# Altium project EDR_V1.PrjPcb
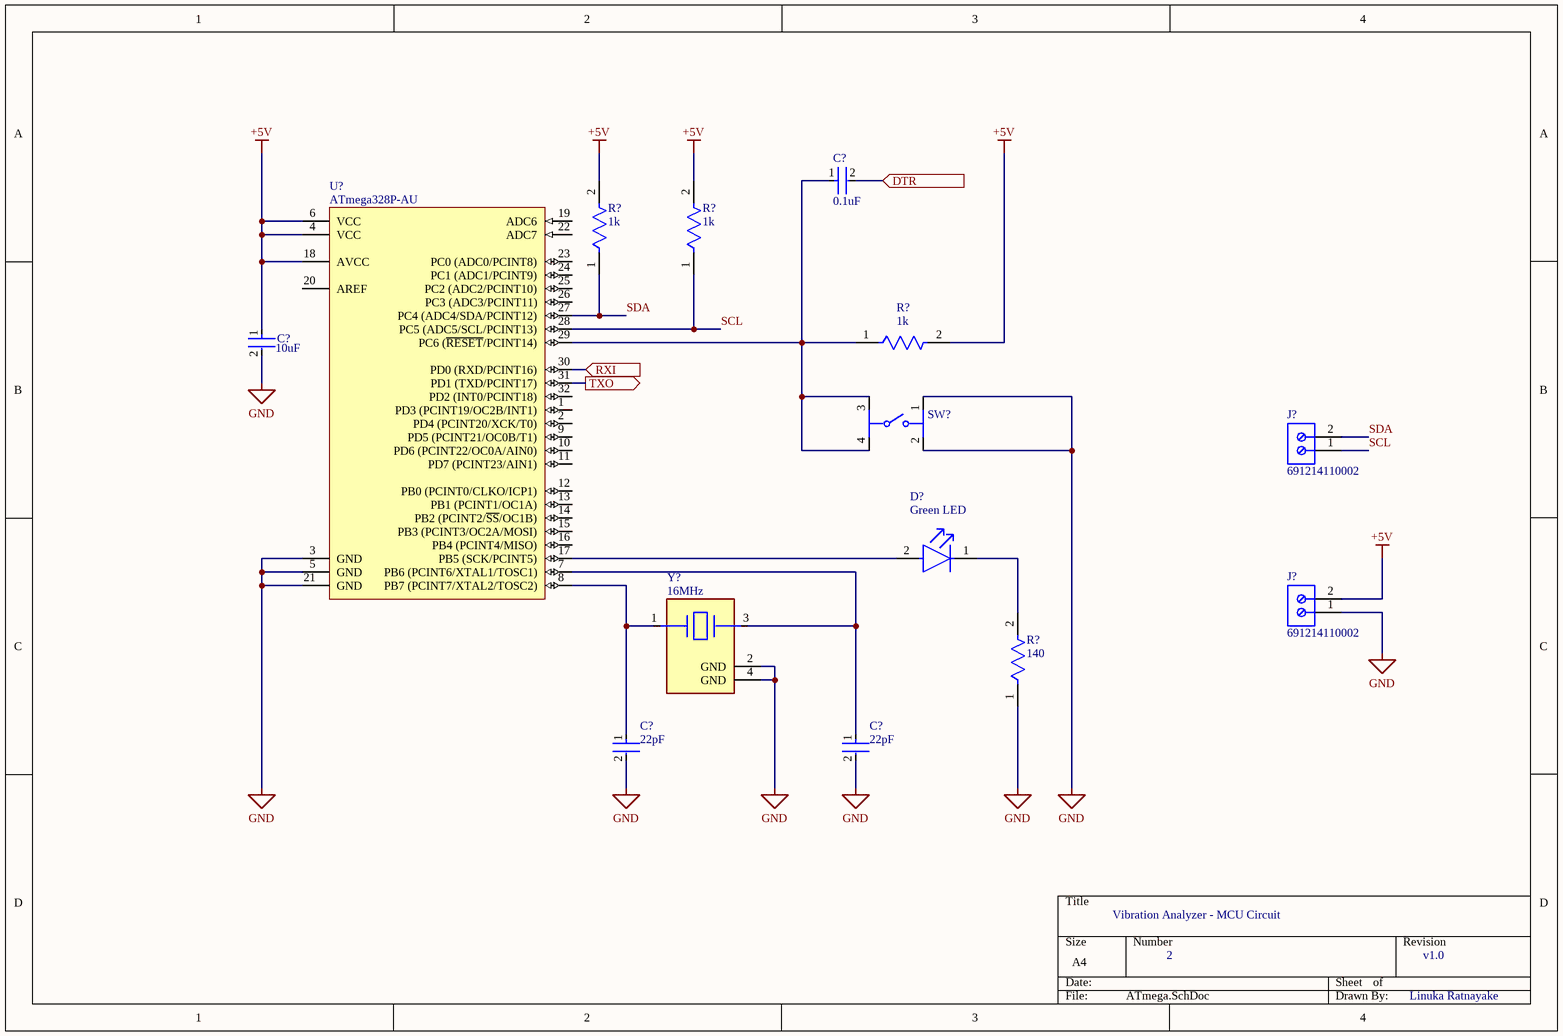
[diagram p0: ATmega.SchDoc]
4 sheets, 39 parts. Net scope: flat (ports and power ports of the same name join across sheets).
Board file: PCB1.PcbDoc
Sheets:
  ATmega.SchDoc
  Power.SchDoc
  FTDI.SchDoc
  Main.SchDoc

## Sheet ATmega.SchDoc
size A4; SheetNumber: 3; SheetTotal: 4

### Parts
(Parts that share a designator on the sheet are numbered #1, #2 ... from top to bottom, then left to right.)
C?#1  Capacitance: 0.1uF  [FP-GRM31M-0_15-IPC_A]  (hidden comment: GRM31M1X1H104JA01L)
C?#2  Capacitance: 10uF  [FP-GRM31M-0_15-IPC_A]  (hidden comment: GRM31M1X1H104JA01L)
C?#3  Capacitance: 22pF  [FP-GRM31M-0_15-IPC_A]  (hidden comment: GRM31M1X1H104JA01L)
C?#4  Capacitance: 22pF  [FP-GRM31M-0_15-IPC_A]  (hidden comment: GRM31M1X1H104JA01L)
D?#1  Color: Green LED  [FP-HSMG-C150-MFG]  (hidden comment: HSMG-C150)
J?#1  691214110002  [691214110002]
J?#2  691214110002  [691214110002]
R?#1  Resistance: 1k  [FP-MCR18-IPC_B]  (hidden comment: MCR18EZPF30R0)
R?#2  Resistance: 1k  [FP-MCR18-IPC_B]  (hidden comment: MCR18EZPF30R0)
R?#3  Resistance: 1k  [FP-MCR18-IPC_B]  (hidden comment: MCR18EZPF30R0)
R?#4  Resistance: 140  [FP-MCR18-IPC_B]  (hidden comment: MCR18EZPF30R0)
SW?#1  PTS645SM43SMTR92LFS  [FP-PTS645SM43SMTR92LFS-MFG]  (value not drawn)
U?#1  ATmega328P-AU  [32A_M]
Y?#1  Frequency: 16MHz  [FP-ABM11-MFG]  (hidden comment: ABM11-16.000MHZ-12-N1G-T)

### Ports
DTR (in, see Main[2B], FTDI[3B]), RXI (in, see Main[2B]), TXO (out, see Main[2B])

### Nets
+5V: C?#2.1 J?#2.2 R?#1.2 R?#2.2 R?#3.2 U?#1.4(VCC) U?#1.6(VCC) U?#1.18(AVCC)
GND: C?#2.2 C?#3.2 C?#4.2 J?#2.1 R?#4.1 SW?#1.1 SW?#1.2 U?#1.3(GND) U?#1.5(GND) U?#1.21(GND) Y?#1.2(GND) Y?#1.4(GND)
SCL: J?#1.1 R?#2.1 U?#1.28(PC5_(ADC5/SCL/PCINT13))
SDA: J?#1.2 R?#1.1 U?#1.27(PC4_(ADC4/SDA/PCINT12))
NetC?#1_1: C?#1.1 R?#3.1 SW?#1.3 SW?#1.4 U?#1.29(PC6_(~{RESET}/PCINT14))
NetC?#1_2: C?#1.2 ; port DTR
NetC?#3_1: C?#3.1 U?#1.8(PB7_(PCINT7/XTAL2/TOSC2)) Y?#1.1
NetC?#4_1: C?#4.1 U?#1.7(PB6_(PCINT6/XTAL1/TOSC1)) Y?#1.3
NetD?#1_1: D?#1.1(C) R?#4.2
NetD?#1_2: D?#1.2(A) U?#1.17(PB5_(SCK/PCINT5))
NetU?#1_30: U?#1.30(PD0_(RXD/PCINT16)) ; port RXI
NetU?#1_31: U?#1.31(PD1_(TXD/PCINT17)) ; port TXO

Not connected (* = marked no-connect by the designer): U?#1 1(PD3_(PCINT19/OC2B/INT1)) 2(PD4_(PCINT20/XCK/T0)) 9(PD5_(PCINT21/OC0B/T1)) 10(PD6_(PCINT22/OC0A/AIN0)) 11(PD7_(PCINT23/AIN1)) 12(PB0_(PCINT0/CLKO/ICP1)) 13(PB1_(PCINT1/OC1A)) 14(PB2_(PCINT2/~{SS}/OC1B)) 15(PB3_(PCINT3/OC2A/MOSI)) 16(PB4_(PCINT4/MISO)) 19(ADC6) 20(AREF) 22(ADC7) 23(PC0_(ADC0/PCINT8)) 24(PC1_(ADC1/PCINT9)) 25(PC2_(ADC2/PCINT10)) 26(PC3_(ADC3/PCINT11)) 32(PD2_(INT0/PCINT18))

### Notes on the sheet
- Vibration Analyzer - MCU Circuit
- 2
- v1.0
- Linuka Ratnayake

### Library data of the parts
C?#1-C?#4 = CMP-06035-007547-1: Chip Multilayer Ceramic Capacitors for General Purpose, 1206, 0.10uF, SL, +350/-1000ppm/°C, 5%, 50V; Dissipation Factor: 0.025%; Packaging: Tape and Reel; Length: 0.126inch; Case Code (Imperial): 1206; Voltage Rating (DC): 50V; Max Operating Temperature: 125°C; Voltage: 50V; Height: 1.15mm; Width: 0.063inch; Voltage Rating: 50V; Tolerance: 5%; Min Operating Temperature: -55°C; Mount: Surface Mount; Dielectric Material: Ceramic; Termination: SMD/SMT; Depth: 1.6mm; Case Code (Metric): 3216; Case/Package: 1206; Temperature Coefficient: -1000ppm/°C; Thickness: 0.049inch
D?#1 = CMP-2000-05061-2: LED GREEN DIFFUSED 1206 SMD; Manufacturer: Broadcom; Led Orientation: Top View; Max Junction Temp: +95°C; Peak Emmision Wavelength: 570nm; Viewing Angle: 170°; Wavelength: 572nm; Reverse Voltage: 5V; Luminous Intensity: 15mcd; Description: Surface Mount Chip LEDs; Forward Voltage: 2.2V; Power Dissipation: 65mW; Forward Current: 20mA; ComponentLink2Description: Datasheet; Lead Free: Yes; Temperature Range Low: -40°C; Package: HSMG-C150; Digikey Description: LED GREEN DIFFUSED 1206 SMD; Mouser Description: LED Uni-Color Green 570nm 2-Pin Chip LED T/R; Manufacturer Part Number: HSMG-C150; Temperature Range High: +85°C; Device Class L1: Optoelectronics; Colour: Green; Category: Diode; Device Class L3: unset; RoHS: TRUE; Height: 1.2mm; ComponentLink2URL: https://docs.broadcom.com/docs/AV02-0551EN; Device Class L2: LEDs; Automotive: No; Ipc Land Pattern Name: DIOCP320160X55; Octopart: https://octopart.com/hsmg-c150-broadcom-71131304; Temperature: -40°C to +85°C
J?#1 J?#2 = CMP-1502-02464-2: NexarPartId: 18818288; Plating: Brass, Steel; Current: 10A; Pitch: 3.5052mm; Number of Levels: 1; Number of Contacts: 2; Wire Gauge (Min): 16AWG; Voltage: 300V; Wire Gauge (Max): 24AWG; Stripping Length: -6mm; Number of Pins: 2; Number of Rows: 1; REACH SVHC: Unknown; RoHS: Compliant; Housing Material: Nylon; Termination: Screw; Mount: Through Hole; Contact Plating: Brass, Tin; Number of Positions Per Level: 2; Color: Blue, Green; Width: 7.9mm; Voltage Rating: 300V; Length: 7.4mm; Current Rating: 10A; Wire/Cable Gauge: 24AWG; Packaging: Box; Max Operating Temperature: 105°C; Lead Pitch: 3.5mm; Height: 8.7mm; Contact Material: Brass; Min Operating Temperature: -40°C
R?#1-R?#4 = CMP-08839-012195-1: Thick Film Chip Resistor, 1206, 30Ω, 1%, 100ppm/°C, 0.25W, 200V; Max Power Dissipation: 250mW; Case Code (Imperial): 1206; Case Code (Metric): 3216; Resistor Type: Thick Film; Tolerance: 1%; Package Quantity: 5000; Height: 0.026inch; RoHS Compliant: Yes; Series: MCR18; Number of Terminations: 2; Lead Free: Lead Free; Width: 0.063inch; Length: 0.126inch; Case/Package: 1206; Packaging: Tape and Reel; Features: Automotive AEC-Q200; Voltage Rating (DC): 200V; Temperature Coefficient: 100ppm/°C
SW?#1 = CMP-2000-05160-2: SWITCH TACTILE SPST-NO 0.05A 12V; Contact Resistance: 100mR; Throw Configuration: SPST; Illumination Type: Non-Illuminated; Mechanical Life: 100000Cycles; Current Rating: 50mA; Switch Function: Off-Mom; Actuator Length: 0.85mm; Actuator Material: Nylon; Actuator Type: Standard; Operating Force: 160gf; Min Operating Temperature: -20°C; REACH SVHC: No SVHC; Termination: Gull Wing; Case/Package: SMD/SMT; Packaging: Tape and Reel; Mount: Surface Mount; Voltage Rating (DC): 12V; Orientation: Straight; Lead Free: Lead Free; Contact Material: Silver; Color: Black; Max Current Rating: 50mA; Contact Plating: Silver; Depth: 9mm; Package Quantity: 1; Max Voltage Rating (DC): 12V; Length: 6mm; Max Operating Temperature: 60°C
U?#1 = CMP-0095-00269-2: 8-bit AVR Microcontroller, 32KB Flash, 1KB EEPROM, 2KB SRAM, 32-pin TQFP, Industrial Grade (-40°C to 85°C); PackageDescription: 32-Lead, 7x7x1.0 mm Body, 0.8mm Lead Pitch, Thin Profile Plastic Quad Flat Package (TQFP); DatasheetVersion: revD, May-2011; RevisionNote: DatasheetVersion & PackageVersion updated. URLs added.; ComponentLink1URL: http://www.atmel.com/; ComponentLink2Description: ATmega48A/48PA/88A/88PA/168A/168PA/328/328P Datasheet; Code_JEDEC: MS-026-ABA; ComponentLink1Description: Manufacturer URL; PackageReference: 32A; ComponentLink3Description: ATmega48A/48PA/88A/88PA/168A/168PA/328/328P Summary; ComponentLink2URL: http://www.atmel.com/dyn/resources/prod_documents/doc8271.pdf; PackageVersion: revC, Oct-2010; ComponentLink3URL: http://www.atmel.com/dyn/resources/prod_documents/8271S.pdf
Y?#1 = CMP-27762-009218-1: Crystal 16MHz ±10ppm 12pF SMD-4 2mm x 1.6mm

## Sheet Power.SchDoc
size A; SheetNumber: 2; SheetTotal: 2

## Sheet FTDI.SchDoc
size A4; SheetNumber: 4; SheetTotal: 4
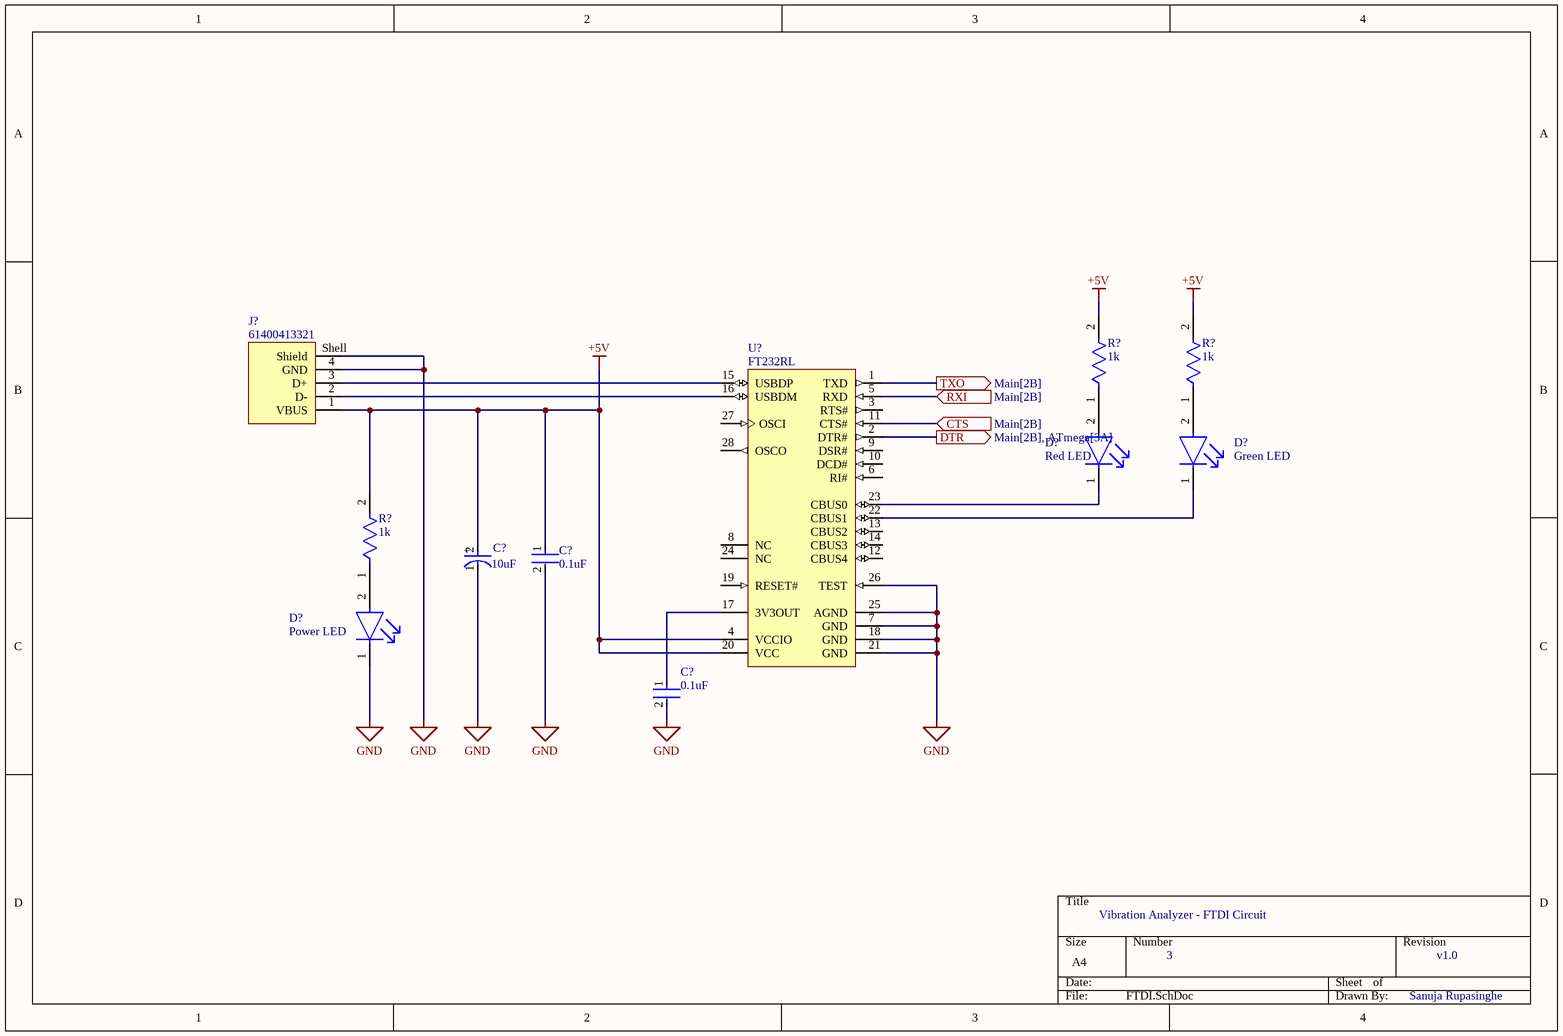
[diagram p1: FTDI.SchDoc]

### Parts
(Parts that share a designator on the sheet are numbered #1, #2 ... from top to bottom, then left to right.)
C?#5  Capacitance: 10uF  [FP-SC-MFG]  (hidden comment: EEE1VA100SR)
C?#6  Capacitance: 0.1uF  [FP-GRM31M-0_15-IPC_A]  (hidden comment: GRM31M1X1H104JA01L)
C?#7  Capacitance: 0.1uF  [FP-GRM31M-0_15-IPC_A]  (hidden comment: GRM31M1X1H104JA01L)
D?#2  Color: Red LED  [FP-HSMG-C150-MFG]  (hidden comment: HSMG-C150)
D?#3  Color: Green LED  [FP-HSMG-C150-MFG]  (hidden comment: HSMG-C150)
D?#4  Color: Power LED  [FP-HSMG-C150-MFG]  (hidden comment: HSMG-C150)
J?#3  61400413321  [61400413321]
R?#5  Resistance: 1k  [FP-MCR18-IPC_B]  (hidden comment: MCR18EZPF30R0)
R?#6  Resistance: 1k  [FP-MCR18-IPC_B]  (hidden comment: MCR18EZPF30R0)
R?#7  Resistance: 1k  [FP-MCR18-IPC_B]  (hidden comment: MCR18EZPF30R0)
U?#2  FT232RL  [FTDI-SSOP-28_M]

### Ports
CTS (in, see Main[2B]), DTR (out, see Main[2B], ATmega[3A]), RXI (in, see Main[2B]), TXO (out, see Main[2B])

### Nets
+5V: C?#5.2(A) C?#6.1 J?#3.1(VBUS) R?#5.2 R?#6.2 R?#7.2 U?#2.4(VCCIO) U?#2.20(VCC)
GND: C?#5.1(C) C?#6.2 C?#7.2 D?#4.1(C) J?#3.4(GND) J?#3.Shell(Shield) U?#2.7(GND) U?#2.18(GND) U?#2.21(GND) U?#2.25(AGND) U?#2.26(TEST)
NetC?#1_2: U?#2.2(DTR#) ; port DTR
NetC?#7_1: C?#7.1 U?#2.17(3V3OUT)
NetD?#2_1: D?#2.1(C) U?#2.23(CBUS0)
NetD?#2_2: D?#2.2(A) R?#5.1
NetD?#3_1: D?#3.1(C) U?#2.22(CBUS1)
NetD?#3_2: D?#3.2(A) R?#6.1
NetD?#4_2: D?#4.2(A) R?#7.1
NetJ?#3_2: J?#3.2(D-) U?#2.16(USBDM)
NetJ?#3_3: J?#3.3(D+) U?#2.15(USBDP)
NetU?#1_30: U?#2.5(RXD) ; port RXI
NetU?#1_31: U?#2.1(TXD) ; port TXO
NetU?#2_11: U?#2.11(CTS#) ; port CTS

Not connected (* = marked no-connect by the designer): U?#2 3(RTS#) 6(RI#) 8(NC) 9(DSR#) 10(DCD#) 12(CBUS4) 13(CBUS2) 14(CBUS3) 19(RESET#) 24(NC) 27(OSCI) 28(OSCO)

### Notes on the sheet
- Vibration Analyzer - FTDI Circuit
- 3
- v1.0
- Sanuja Rupasinghe
- (in symbol CMP-05427-000087-1) +

### Library data of the parts
C?#5 = CMP-05427-000087-1: CAP ALUM 10UF 20% 35V SMD; Life (Hours): 2000Hour; Lead Length: 2.2mm; Ripple Current (AC): 30mA; Leakage Current: 3uA; Length: 5.5mm; Construction: Cylindrical; Diameter: 5mm; RoHS Compliant: Yes; REACH SVHC: No SVHC; Max Operating Temperature: 85°C; Series: S; Case/Package: Radial; Contact Plating: Tin; Packaging: Tape and Reel; Voltage Rating: 35V; Number of Pins: 2; Height: 5.4mm; Width: 5.3mm; Voltage Rating (DC): 35V; Mount: Surface Mount; Tolerance: 20%; Lead Pitch: 1.5mm; Radiation Hardening: No; Height - Seated (Max): 0.213inch; Ripple Current: 30mA; Voltage: 35V; Package Quantity: 1; Termination: SMD/SMT; Min Operating Temperature: -40°C
C?#6 C?#7 = CMP-06035-007547-1: as C?#1 on sheet ATmega; Packaging: Tape and Reel; Length: 0.126inch; Case Code (Imperial): 1206; Voltage Rating (DC): 50V; Max Operating Temperature: 125°C; Voltage: 50V; Height: 1.15mm; Width: 0.063inch; Voltage Rating: 50V; Tolerance: 5%; Min Operating Temperature: -55°C; Mount: Surface Mount; Dielectric Material: Ceramic; Termination: SMD/SMT; Depth: 1.6mm; Case Code (Metric): 3216; Case/Package: 1206; Temperature Coefficient: -1000ppm/°C; Thickness: 0.049inch
D?#2-D?#4 = CMP-2000-05061-2: LED GREEN DIFFUSED 1206 SMD; Manufacturer: Broadcom; Led Orientation: Top View; Max Junction Temp: +95°C; Peak Emmision Wavelength: 570nm; Viewing Angle: 170°; Wavelength: 572nm; Reverse Voltage: 5V; Luminous Intensity: 15mcd; Forward Voltage: 2.2V; Power Dissipation: 65mW; Forward Current: 20mA; ComponentLink2Description: Datasheet; Lead Free: Yes; Temperature Range Low: -40°C; Package: HSMG-C150; Digikey Description: LED GREEN DIFFUSED 1206 SMD; Mouser Description: LED Uni-Color Green 570nm 2-Pin Chip LED T/R; Manufacturer Part Number: HSMG-C150; Temperature Range High: +85°C; Device Class L1: Optoelectronics; Colour: Green; Category: Diode; Device Class L3: unset; RoHS: TRUE; Height: 1.2mm; ComponentLink2URL: https://docs.broadcom.com/docs/AV02-0551EN; Device Class L2: LEDs; Automotive: No; Ipc Land Pattern Name: DIOCP320160X55; Octopart: https://octopart.com/hsmg-c150-broadcom-71131304; Temperature: -40°C to +85°C
J?#3 = CMP-1502-03246-2: NexarPartId: 18818176; Contact Resistance: 20mΩ; USB Standard: USB 2.0; Current Rating: 1.5A; Number of Positions: 4; Number of Ports: 1; Gender: Receptacle; Voltage Rating: 30V; Connector Type: USB; Insulation Resistance: 1GΩ; Contact Plating: Gold; Termination: Solder; Number of Pins: 4; REACH SVHC: Unknown; Lead Free: Lead Free; Contact Material: Gold; Color: White; RoHS: Compliant; Number of Contacts: 4; Length: 14.8mm; Width: 19.15mm; Mount: PCB, Through Hole, Vertical; Orientation: Vertical; Insulation Material: PBT; Features: Shielded; Operating Supply Voltage: 30V; Min Operating Temperature: -40°C; Max Operating Temperature: 105°C; Height: 16.3mm
R?#5-R?#7 = CMP-08839-012195-1: as R?#1 on sheet ATmega; Case Code (Imperial): 1206; Case Code (Metric): 3216; Resistor Type: Thick Film; Tolerance: 1%; Package Quantity: 5000; Height: 0.026inch; RoHS Compliant: Yes; Series: MCR18; Number of Terminations: 2; Lead Free: Lead Free; Width: 0.063inch; Length: 0.126inch; Case/Package: 1206; Packaging: Tape and Reel; Features: Automotive AEC-Q200; Voltage Rating (DC): 200V; Temperature Coefficient: 100ppm/°C
U?#2 = CMP-2000-05029-1: IC USB FS SERIAL UART 28-SSOP; Manufacturer: FTDI; Receive FIFO: 256B; Number of Channels per Chip: 1; Maximum Data Rate: 3MBd; Transmit FIFO: 128B; Dimensions: 10.2x5.3x1.75mm; Mounting Type: SurfaceMount; Height: 1.75mm; Package Type: SSOP; Datasheet Version: Rev. 1.04, 02/2006; Width: 5.3mm; Manufacturer URL: http://www.ftdichip.com/; Datasheet URL: http://datasheet.octopart.com/FT232RL-FTDI-datasheet-120501.pdf; Maximum Operating Temperature: +85degC; Minimum Operating Temperature: -40degC; Pin Count: 28; Length: 10.2mm

## Sheet Main.SchDoc
size A4; SheetNumber: 1; SheetTotal: 3
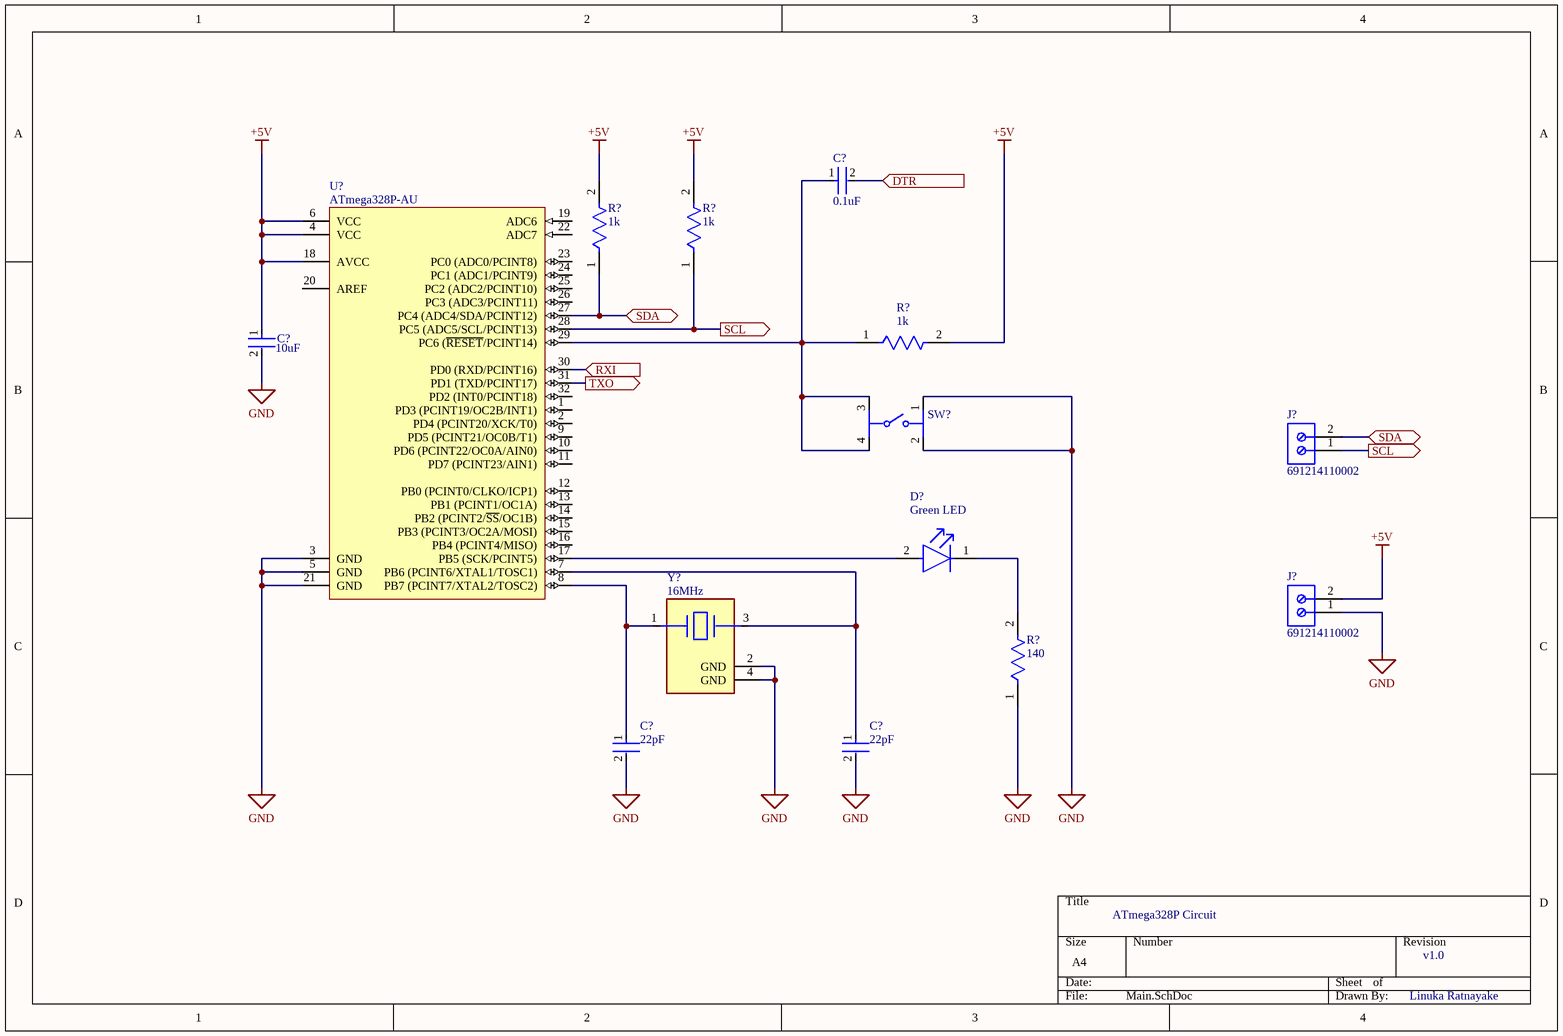
[diagram p2: Main.SchDoc]

### Parts
(Parts that share a designator on the sheet are numbered #1, #2 ... from top to bottom, then left to right.)
C?#8  Capacitance: 0.1uF  [FP-GRM31M-0_15-IPC_A]  (hidden comment: GRM31M1X1H104JA01L)
C?#9  Capacitance: 10uF  [FP-GRM31M-0_15-IPC_A]  (hidden comment: GRM31M1X1H104JA01L)
C?#10  Capacitance: 22pF  [FP-GRM31M-0_15-IPC_A]  (hidden comment: GRM31M1X1H104JA01L)
C?#11  Capacitance: 22pF  [FP-GRM31M-0_15-IPC_A]  (hidden comment: GRM31M1X1H104JA01L)
D?#5  Color: Green LED  [FP-HSMG-C150-MFG]  (hidden comment: HSMG-C150)
J?#4  691214110002  [691214110002]
J?#5  691214110002  [691214110002]
R?#8  Resistance: 1k  [FP-MCR18-IPC_B]  (hidden comment: MCR18EZPF30R0)
R?#9  Resistance: 1k  [FP-MCR18-IPC_B]  (hidden comment: MCR18EZPF30R0)
R?#10  Resistance: 1k  [FP-MCR18-IPC_B]  (hidden comment: MCR18EZPF30R0)
R?#11  Resistance: 140  [FP-MCR18-IPC_B]  (hidden comment: MCR18EZPF30R0)
SW?#2  PTS645SM43SMTR92LFS  [FP-PTS645SM43SMTR92LFS-MFG]  (value not drawn)
U?#3  ATmega328P-AU  [32A_M]
Y?#2  Frequency: 16MHz  [FP-ABM11-MFG]  (hidden comment: ABM11-16.000MHZ-12-N1G-T)

### Ports
DTR (in, see FTDI[3B]), RXI (in, see FTDI[3B]), SCL (out, see Main[2B]), SCL (out, see Main[4B]), SDA (bidir, see Main[2B]), SDA (bidir, see Main[4B]), TXO (out, see FTDI[3B])

### Nets
+5V: C?#9.1 J?#5.2 R?#8.2 R?#9.2 R?#10.2 U?#3.4(VCC) U?#3.6(VCC) U?#3.18(AVCC)
GND: C?#9.2 C?#10.2 C?#11.2 J?#5.1 R?#11.1 SW?#2.1 SW?#2.2 U?#3.3(GND) U?#3.5(GND) U?#3.21(GND) Y?#2.2(GND) Y?#2.4(GND)
NetC?#1_2: C?#8.2 ; port DTR
NetC?#8_1: C?#8.1 R?#10.1 SW?#2.3 SW?#2.4 U?#3.29(PC6_(~{RESET}/PCINT14))
NetC?#10_1: C?#10.1 U?#3.8(PB7_(PCINT7/XTAL2/TOSC2)) Y?#2.1
NetC?#11_1: C?#11.1 U?#3.7(PB6_(PCINT6/XTAL1/TOSC1)) Y?#2.3
NetD?#5_1: D?#5.1(C) R?#11.2
NetD?#5_2: D?#5.2(A) U?#3.17(PB5_(SCK/PCINT5))
NetJ?#4_1: J?#4.1 R?#9.1 U?#3.28(PC5_(ADC5/SCL/PCINT13)) ; port SCL
NetJ?#4_2: J?#4.2 R?#8.1 U?#3.27(PC4_(ADC4/SDA/PCINT12)) ; port SDA
NetU?#1_30: U?#3.30(PD0_(RXD/PCINT16)) ; port RXI
NetU?#1_31: U?#3.31(PD1_(TXD/PCINT17)) ; port TXO

Not connected (* = marked no-connect by the designer): U?#3 1(PD3_(PCINT19/OC2B/INT1)) 2(PD4_(PCINT20/XCK/T0)) 9(PD5_(PCINT21/OC0B/T1)) 10(PD6_(PCINT22/OC0A/AIN0)) 11(PD7_(PCINT23/AIN1)) 12(PB0_(PCINT0/CLKO/ICP1)) 13(PB1_(PCINT1/OC1A)) 14(PB2_(PCINT2/~{SS}/OC1B)) 15(PB3_(PCINT3/OC2A/MOSI)) 16(PB4_(PCINT4/MISO)) 19(ADC6) 20(AREF) 22(ADC7) 23(PC0_(ADC0/PCINT8)) 24(PC1_(ADC1/PCINT9)) 25(PC2_(ADC2/PCINT10)) 26(PC3_(ADC3/PCINT11)) 32(PD2_(INT0/PCINT18))

### Notes on the sheet
- ATmega328P Circuit
- v1.0
- Linuka Ratnayake

### Library data of the parts
C?#8-C?#11 = CMP-06035-007547-1: as C?#1 on sheet ATmega; Packaging: Tape and Reel; Length: 0.126inch; Case Code (Imperial): 1206; Voltage Rating (DC): 50V; Max Operating Temperature: 125°C; Voltage: 50V; Height: 1.15mm; Width: 0.063inch; Voltage Rating: 50V; Tolerance: 5%; Min Operating Temperature: -55°C; Mount: Surface Mount; Dielectric Material: Ceramic; Termination: SMD/SMT; Depth: 1.6mm; Case Code (Metric): 3216; Case/Package: 1206; Temperature Coefficient: -1000ppm/°C; Thickness: 0.049inch
D?#5 = CMP-2000-05061-2: as D?#1 on sheet ATmega; ComponentLink2Description: Datasheet; Lead Free: Yes; Temperature Range Low: -40°C; Package: HSMG-C150; Digikey Description: LED GREEN DIFFUSED 1206 SMD; Mouser Description: LED Uni-Color Green 570nm 2-Pin Chip LED T/R; Manufacturer Part Number: HSMG-C150; Temperature Range High: +85°C; Device Class L1: Optoelectronics; Colour: Green; Category: Diode; Device Class L3: unset; RoHS: TRUE; Height: 1.2mm; ComponentLink2URL: https://docs.broadcom.com/docs/AV02-0551EN; Device Class L2: LEDs; Automotive: No; Ipc Land Pattern Name: DIOCP320160X55; Octopart: https://octopart.com/hsmg-c150-broadcom-71131304; Temperature: -40°C to +85°C
J?#4 J?#5 = CMP-1502-02464-2: as J?#1 on sheet ATmega; Number of Pins: 2; Number of Rows: 1; REACH SVHC: Unknown; RoHS: Compliant; Housing Material: Nylon; Termination: Screw; Mount: Through Hole; Contact Plating: Brass, Tin; Number of Positions Per Level: 2; Color: Blue, Green; Width: 7.9mm; Voltage Rating: 300V; Length: 7.4mm; Current Rating: 10A; Wire/Cable Gauge: 24AWG; Packaging: Box; Max Operating Temperature: 105°C; Lead Pitch: 3.5mm; Height: 8.7mm; Contact Material: Brass; Min Operating Temperature: -40°C
R?#8-R?#11 = CMP-08839-012195-1: as R?#1 on sheet ATmega; Case Code (Imperial): 1206; Case Code (Metric): 3216; Resistor Type: Thick Film; Tolerance: 1%; Package Quantity: 5000; Height: 0.026inch; RoHS Compliant: Yes; Series: MCR18; Number of Terminations: 2; Lead Free: Lead Free; Width: 0.063inch; Length: 0.126inch; Case/Package: 1206; Packaging: Tape and Reel; Features: Automotive AEC-Q200; Voltage Rating (DC): 200V; Temperature Coefficient: 100ppm/°C
SW?#2 = CMP-2000-05160-2: as SW?#1 on sheet ATmega; Min Operating Temperature: -20°C; REACH SVHC: No SVHC; Termination: Gull Wing; Case/Package: SMD/SMT; Packaging: Tape and Reel; Mount: Surface Mount; Voltage Rating (DC): 12V; Orientation: Straight; Lead Free: Lead Free; Contact Material: Silver; Color: Black; Max Current Rating: 50mA; Contact Plating: Silver; Depth: 9mm; Package Quantity: 1; Max Voltage Rating (DC): 12V; Length: 6mm; Max Operating Temperature: 60°C
U?#3 = CMP-0095-00269-2: as U?#1 on sheet ATmega; PackageDescription: 32-Lead, 7x7x1.0 mm Body, 0.8mm Lead Pitch, Thin Profile Plastic Quad Flat Package (TQFP); DatasheetVersion: revD, May-2011; RevisionNote: DatasheetVersion & PackageVersion updated. URLs added.; ComponentLink1URL: http://www.atmel.com/; ComponentLink2Description: ATmega48A/48PA/88A/88PA/168A/168PA/328/328P Datasheet; Code_JEDEC: MS-026-ABA; ComponentLink1Description: Manufacturer URL; PackageReference: 32A; ComponentLink3Description: ATmega48A/48PA/88A/88PA/168A/168PA/328/328P Summary; ComponentLink2URL: http://www.atmel.com/dyn/resources/prod_documents/doc8271.pdf; PackageVersion: revC, Oct-2010; ComponentLink3URL: http://www.atmel.com/dyn/resources/prod_documents/8271S.pdf
Y?#2 = CMP-27762-009218-1: as Y?#1 on sheet ATmega

## Nets that join several sheets
+5V: ATmega (8 pins), FTDI (8 pins), Main (8 pins)
GND: ATmega (12 pins), FTDI (11 pins), Main (12 pins)
NetC?#1_2: ATmega (C?#1.2), FTDI (U?#2.2), Main (C?#8.2)
NetU?#1_30: ATmega (U?#1.30), FTDI (U?#2.5), Main (U?#3.30)
NetU?#1_31: ATmega (U?#1.31), FTDI (U?#2.1), Main (U?#3.31)